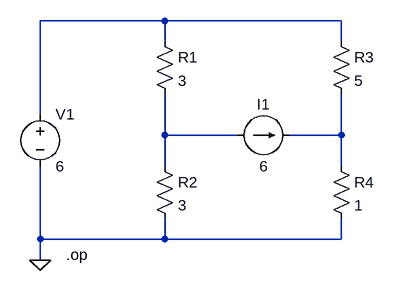
[diagram p0: schematic CH03-KP3-02.asc]
CH03-KP3-02.asc, the LTspice schematic file:
Version 4
SHEET 1 880 680
WIRE 240 160 48 160
WIRE 512 160 240 160
WIRE 240 192 240 160
WIRE 512 192 512 160
WIRE 48 304 48 160
WIRE 240 336 240 272
WIRE 352 336 240 336
WIRE 512 336 512 272
WIRE 512 336 432 336
WIRE 240 384 240 336
WIRE 512 384 512 336
WIRE 48 496 48 384
WIRE 240 496 240 464
WIRE 240 496 48 496
WIRE 512 496 512 464
WIRE 512 496 240 496
WIRE 48 528 48 496
FLAG 48 528 0
DATAFLAG 512 336 "$"
SYMBOL res 224 176 R0
SYMATTR InstName R1
SYMATTR Value 3
SYMBOL res 224 368 R0
SYMATTR InstName R2
SYMATTR Value 3
SYMBOL res 496 176 R0
SYMATTR InstName R3
SYMATTR Value 5
SYMBOL res 496 368 R0
SYMATTR InstName R4
SYMATTR Value 1
SYMBOL voltage 48 288 R0
SYMATTR InstName V1
SYMATTR Value 6
SYMBOL current 352 336 R270
WINDOW 0 32 40 VTop 2
WINDOW 3 -32 40 VBottom 2
SYMATTR InstName I1
SYMATTR Value 6
TEXT 88 520 Left 2 !.op

The netlist it stands for:
* CH03-KP3-02.asc
R1 N001 N002 3
R2 N002 0 3
R3 N001 N003 5
R4 N003 0 1
V1 N001 0 6
I1 N002 N003 6
.op
.backanno
.end